# Altium schematic sheet Connectors.SchDoc
size A4; CompanyName: Technische Hochschule Nürnberg Georg Simon Ohm; Organization: UltraZohm; Address1: Kesslerplatz 12; Address2: 90489 Nürnberg; Address3: GERMANY; DocumentNumber: 2; SheetNumber: 2; SheetTotal: 2; Website: www.ultrazohm.com
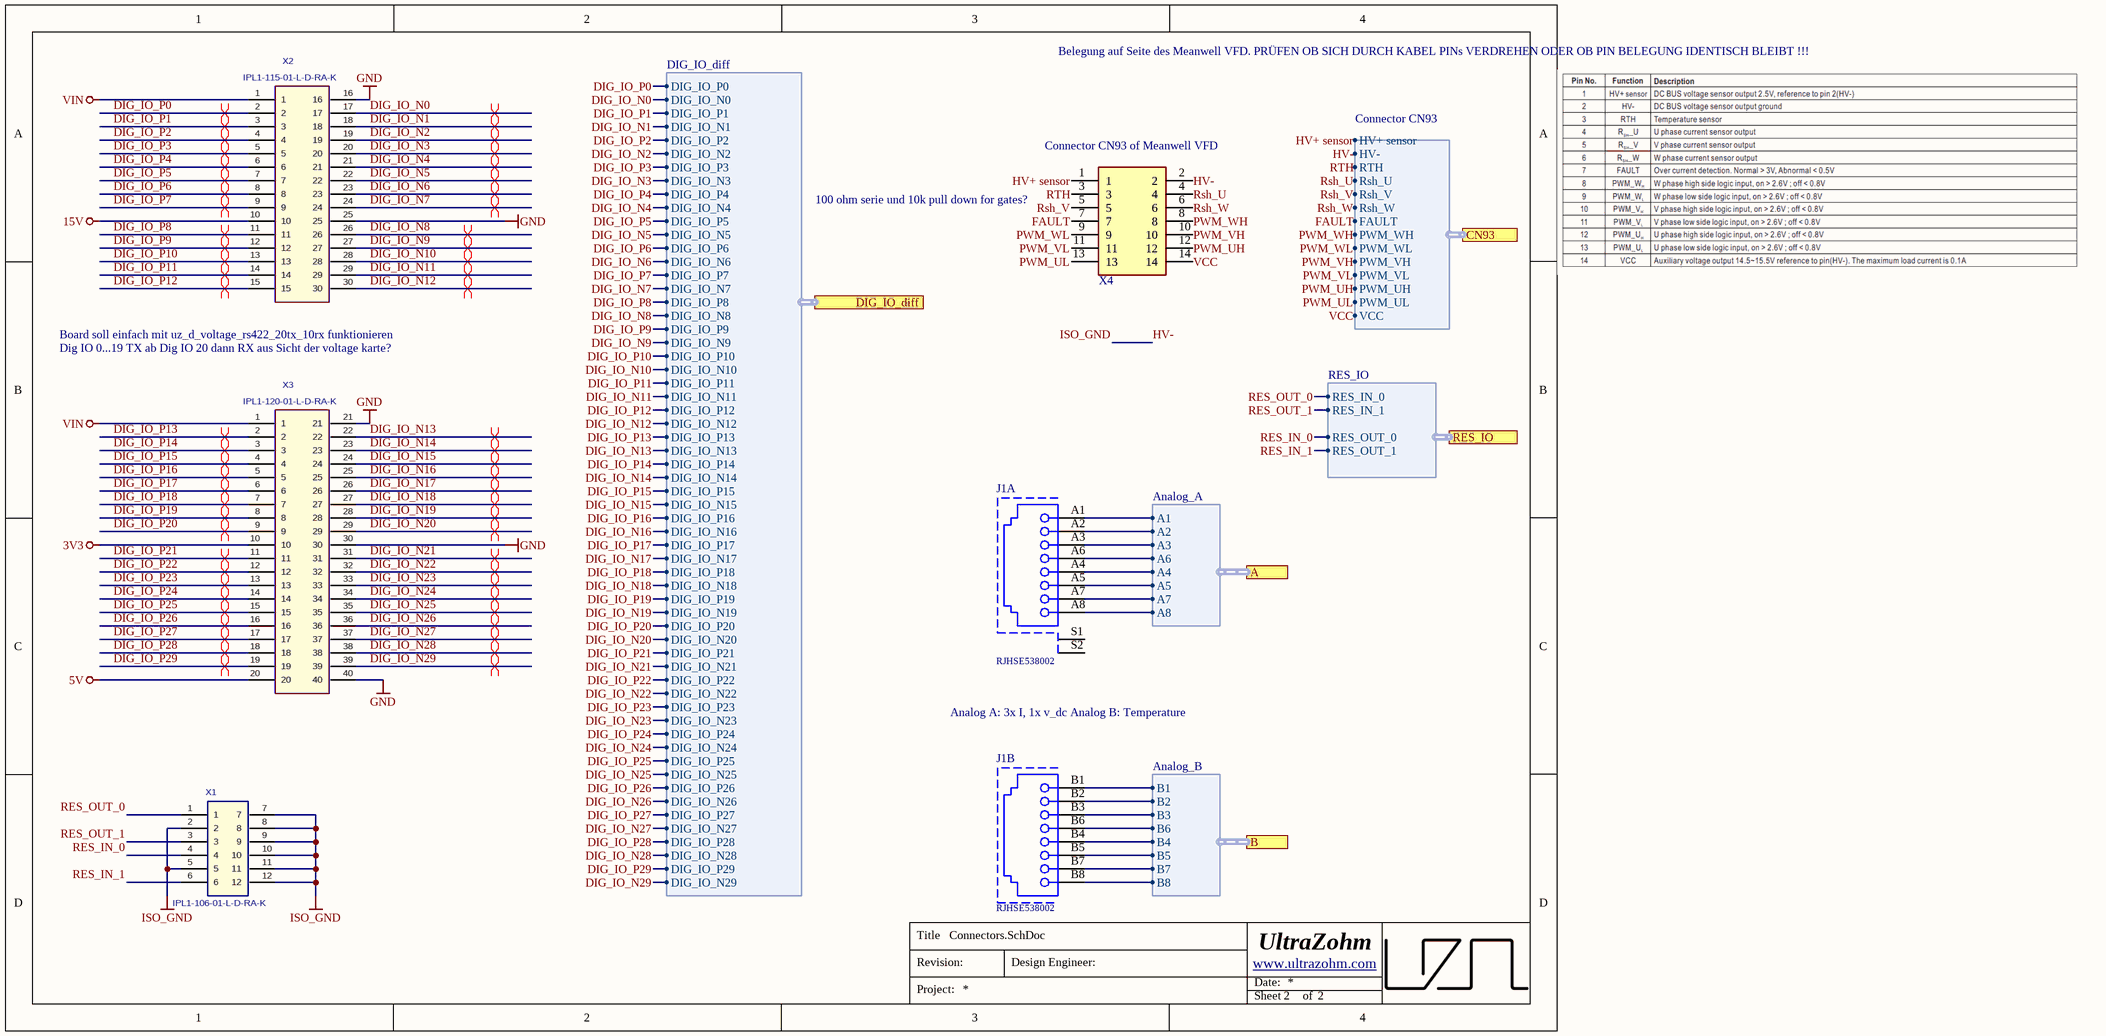
[diagram p0: Connectors.SchDoc]

## Parts
J1  RJHSE538002  [RJHSE-5380-02]  (parts A,B of 2)
X1  IPL1-106-01-L-D-RA-K  [IPL1-106-01-L-D-RA-K]
X2  IPL1-115-01-L-D-RA-K  [IPL1-115-01-XX-D-RA]
X3  IPL1-120-01-L-D-RA-K  [IPL1-120-01-XX-D-RA]
X4  (no value)  [DF11-14DP-2DS(24)]

## Ports
A (harness Analog_A), B (harness Analog_B), CN93 (harness Connector CN93), DIG_IO_diff (harness DIG_IO_diff), RES_IO (harness RES_IO)

## Harnesses
Analog_A: A2, A3, A6, A4, A5, A7, A8, A1
Analog_B: B3, B6, B4, B5, B7, B8, B1, B2
DIG_IO_diff: DIG_IO_N0, DIG_IO_P1, DIG_IO_N1, DIG_IO_P2, DIG_IO_N2, DIG_IO_P3, DIG_IO_N3, DIG_IO_P4, DIG_IO_N4, DIG_IO_P5, DIG_IO_N5, DIG_IO_P6, DIG_IO_N6, DIG_IO_P7, DIG_IO_N7, DIG_IO_P8, DIG_IO_N8, DIG_IO_P9, DIG_IO_N9, DIG_IO_P10, DIG_IO_N10, DIG_IO_P11, DIG_IO_N11, DIG_IO_P12, DIG_IO_N12, DIG_IO_N13, DIG_IO_P14, DIG_IO_N14, DIG_IO_P0, DIG_IO_P15, DIG_IO_N15, DIG_IO_P16, DIG_IO_N16, DIG_IO_P17, DIG_IO_N17, DIG_IO_P18, DIG_IO_N18, DIG_IO_P19, DIG_IO_N19, DIG_IO_P20, DIG_IO_N20, DIG_IO_P21, DIG_IO_P22, DIG_IO_N22, DIG_IO_P23, DIG_IO_N23, DIG_IO_P24, DIG_IO_N24, DIG_IO_P25, DIG_IO_N25, DIG_IO_P26, DIG_IO_N26, DIG_IO_P27, DIG_IO_N27, DIG_IO_P28, DIG_IO_N28, DIG_IO_P29, DIG_IO_N29, DIG_IO_P13, DIG_IO_N21
Connector CN93: HV+ sensor, HV-, RTH, Rsh_U, Rsh_V, Rsh_W, FAULT, PWM_WH, PWM_WL, PWM_VH, PWM_VL, PWM_UH, PWM_UL, VCC
RES_IO: RES_IN_0, RES_IN_1, RES_OUT_0, RES_OUT_1

## Nets
3V3: X3.10
5V: X3.20
15V: X2.10
GND: X2.16 X2.25 X3.21 X3.30 X3.40
HV-: X1.2 X1.5 X1.7 X1.8 X1.9 X1.10 X1.11 X1.12 X4.2 ; port CN93.HV-  [also labelled ISO_GND]
VIN: X2.1 X3.1
DIG_IO_N0: X2.17 ; port DIG_IO_diff.DIG_IO_N0
DIG_IO_N1: X2.18 ; port DIG_IO_diff.DIG_IO_N1
DIG_IO_N2: X2.19 ; port DIG_IO_diff.DIG_IO_N2
DIG_IO_N3: X2.20 ; port DIG_IO_diff.DIG_IO_N3
DIG_IO_N4: X2.21 ; port DIG_IO_diff.DIG_IO_N4
DIG_IO_N5: X2.22 ; port DIG_IO_diff.DIG_IO_N5
DIG_IO_N6: X2.23 ; port DIG_IO_diff.DIG_IO_N6
DIG_IO_N7: X2.24 ; port DIG_IO_diff.DIG_IO_N7
DIG_IO_N8: X2.26 ; port DIG_IO_diff.DIG_IO_N8
DIG_IO_N9: X2.27 ; port DIG_IO_diff.DIG_IO_N9
DIG_IO_N10: X2.28 ; port DIG_IO_diff.DIG_IO_N10
DIG_IO_N11: X2.29 ; port DIG_IO_diff.DIG_IO_N11
DIG_IO_N12: X2.30 ; port DIG_IO_diff.DIG_IO_N12
DIG_IO_N13: X3.22 ; port DIG_IO_diff.DIG_IO_N13
DIG_IO_N14: X3.23 ; port DIG_IO_diff.DIG_IO_N14
DIG_IO_N15: X3.24 ; port DIG_IO_diff.DIG_IO_N15
DIG_IO_N16: X3.25 ; port DIG_IO_diff.DIG_IO_N16
DIG_IO_N17: X3.26 ; port DIG_IO_diff.DIG_IO_N17
DIG_IO_N18: X3.27 ; port DIG_IO_diff.DIG_IO_N18
DIG_IO_N19: X3.28 ; port DIG_IO_diff.DIG_IO_N19
DIG_IO_N20: X3.29 ; port DIG_IO_diff.DIG_IO_N20
DIG_IO_N21: X3.31 ; port DIG_IO_diff.DIG_IO_N21
DIG_IO_N22: X3.32 ; port DIG_IO_diff.DIG_IO_N22
DIG_IO_N23: X3.33 ; port DIG_IO_diff.DIG_IO_N23
DIG_IO_N24: X3.34 ; port DIG_IO_diff.DIG_IO_N24
DIG_IO_N25: X3.35 ; port DIG_IO_diff.DIG_IO_N25
DIG_IO_N26: X3.36 ; port DIG_IO_diff.DIG_IO_N26
DIG_IO_N27: X3.37 ; port DIG_IO_diff.DIG_IO_N27
DIG_IO_N28: X3.38 ; port DIG_IO_diff.DIG_IO_N28
DIG_IO_N29: X3.39 ; port DIG_IO_diff.DIG_IO_N29
DIG_IO_P0: X2.2 ; port DIG_IO_diff.DIG_IO_P0
DIG_IO_P1: X2.3 ; port DIG_IO_diff.DIG_IO_P1
DIG_IO_P2: X2.4 ; port DIG_IO_diff.DIG_IO_P2
DIG_IO_P3: X2.5 ; port DIG_IO_diff.DIG_IO_P3
DIG_IO_P4: X2.6 ; port DIG_IO_diff.DIG_IO_P4
DIG_IO_P5: X2.7 ; port DIG_IO_diff.DIG_IO_P5
DIG_IO_P6: X2.8 ; port DIG_IO_diff.DIG_IO_P6
DIG_IO_P7: X2.9 ; port DIG_IO_diff.DIG_IO_P7
DIG_IO_P8: X2.11 ; port DIG_IO_diff.DIG_IO_P8
DIG_IO_P9: X2.12 ; port DIG_IO_diff.DIG_IO_P9
DIG_IO_P10: X2.13 ; port DIG_IO_diff.DIG_IO_P10
DIG_IO_P11: X2.14 ; port DIG_IO_diff.DIG_IO_P11
DIG_IO_P12: X2.15 ; port DIG_IO_diff.DIG_IO_P12
DIG_IO_P13: X3.2 ; port DIG_IO_diff.DIG_IO_P13
DIG_IO_P14: X3.3 ; port DIG_IO_diff.DIG_IO_P14
DIG_IO_P15: X3.4 ; port DIG_IO_diff.DIG_IO_P15
DIG_IO_P16: X3.5 ; port DIG_IO_diff.DIG_IO_P16
DIG_IO_P17: X3.6 ; port DIG_IO_diff.DIG_IO_P17
DIG_IO_P18: X3.7 ; port DIG_IO_diff.DIG_IO_P18
DIG_IO_P19: X3.8 ; port DIG_IO_diff.DIG_IO_P19
DIG_IO_P20: X3.9 ; port DIG_IO_diff.DIG_IO_P20
DIG_IO_P21: X3.11 ; port DIG_IO_diff.DIG_IO_P21
DIG_IO_P22: X3.12 ; port DIG_IO_diff.DIG_IO_P22
DIG_IO_P23: X3.13 ; port DIG_IO_diff.DIG_IO_P23
DIG_IO_P24: X3.14 ; port DIG_IO_diff.DIG_IO_P24
DIG_IO_P25: X3.15 ; port DIG_IO_diff.DIG_IO_P25
DIG_IO_P26: X3.16 ; port DIG_IO_diff.DIG_IO_P26
DIG_IO_P27: X3.17 ; port DIG_IO_diff.DIG_IO_P27
DIG_IO_P28: X3.18 ; port DIG_IO_diff.DIG_IO_P28
DIG_IO_P29: X3.19 ; port DIG_IO_diff.DIG_IO_P29
FAULT: X4.7 ; port CN93.FAULT
HV+ sensor: X4.1 ; port CN93.HV+ sensor
PWM_UH: X4.12 ; port CN93.PWM_UH
PWM_UL: X4.13 ; port CN93.PWM_UL
PWM_VH: X4.10 ; port CN93.PWM_VH
PWM_VL: X4.11 ; port CN93.PWM_VL
PWM_WH: X4.8 ; port CN93.PWM_WH
PWM_WL: X4.9 ; port CN93.PWM_WL
RES_IN_0: X1.4 ; port RES_IO.RES_OUT_0
RES_IN_1: X1.6 ; port RES_IO.RES_OUT_1
RES_OUT_0: X1.1 ; port RES_IO.RES_IN_0
RES_OUT_1: X1.3 ; port RES_IO.RES_IN_1
Rsh_U: X4.4 ; port CN93.Rsh_U
Rsh_V: X4.5 ; port CN93.Rsh_V
Rsh_W: X4.6 ; port CN93.Rsh_W
RTH: X4.3 ; port CN93.RTH
VCC: X4.14 ; port CN93.VCC
NetJ1_A1: J1.A1 ; port A.A1
NetJ1_A2: J1.A2 ; port A.A2
NetJ1_A3: J1.A3 ; port A.A3
NetJ1_A4: J1.A4 ; port A.A4
NetJ1_A5: J1.A5 ; port A.A5
NetJ1_A6: J1.A6 ; port A.A6
NetJ1_A7: J1.A7 ; port A.A7
NetJ1_A8: J1.A8 ; port A.A8
NetJ1_B1: J1.B1 ; port B.B1
NetJ1_B2: J1.B2 ; port B.B2
NetJ1_B3: J1.B3 ; port B.B3
NetJ1_B4: J1.B4 ; port B.B4
NetJ1_B5: J1.B5 ; port B.B5
NetJ1_B6: J1.B6 ; port B.B6
NetJ1_B7: J1.B7 ; port B.B7
NetJ1_B8: J1.B8 ; port B.B8

Not connected (* = marked no-connect by the designer): J1 S1 S2

## Layout directives
differential pair: DIG_IO_N0, DIG_IO_N1, DIG_IO_N2, DIG_IO_N3, DIG_IO_N4, DIG_IO_N5, DIG_IO_N6, DIG_IO_N7, DIG_IO_N8, DIG_IO_N9, DIG_IO_N10, DIG_IO_N11, DIG_IO_N12, DIG_IO_N13, DIG_IO_N14, DIG_IO_N15, DIG_IO_N16, DIG_IO_N17, DIG_IO_N18, DIG_IO_N19, DIG_IO_N20, DIG_IO_N21, DIG_IO_N22, DIG_IO_N23, DIG_IO_N24, DIG_IO_N25, DIG_IO_N26, DIG_IO_N27, DIG_IO_N28, DIG_IO_N29, DIG_IO_P0, DIG_IO_P1, DIG_IO_P2, DIG_IO_P3, DIG_IO_P4, DIG_IO_P5, DIG_IO_P6, DIG_IO_P7, DIG_IO_P8, DIG_IO_P9, DIG_IO_P10, DIG_IO_P11, DIG_IO_P12, DIG_IO_P13, DIG_IO_P14, DIG_IO_P15, DIG_IO_P16, DIG_IO_P17, DIG_IO_P18, DIG_IO_P19, DIG_IO_P20, DIG_IO_P21, DIG_IO_P22, DIG_IO_P23, DIG_IO_P24, DIG_IO_P25, DIG_IO_P26, DIG_IO_P27, DIG_IO_P28, DIG_IO_P29

## Notes on the sheet
- Belegung auf Seite des Meanwell VFD. PRÜFEN OB SICH DURCH KABEL PINs VERDREHEN ODER OB PIN BELEGUNG IDENTISCH BLEIBT !!!
- (near X4) Connector CN93 of Meanwell VFD
- (near X4) 100 ohm serie und 10k pull down for gates?
- (near X2) Board soll einfach mit uz_d_voltage_rs422_20tx_10rx funktionieren
- Dig IO 0...19 TX ab Dig IO 20 dann RX aus Sicht der voltage karte?
- Analog A: 3x I, 1x v_dc Analog B: Temperature
- Title
- Revision:
- Design Engineer:
- Date:
- Project:
- Sheet
- of

## Library data of the parts
J1 = RJHSE538002: CAT5, RJ45 Connector, 1x2; Manufacturer: Amphenol; Created from: MGremer; Manufacturer Part Number: RJHSE538002; PartID: 4; Created On: 22.02.2021 16:43:38; ComponentLink1Description: Datasheet; ComponentLink1URL: https://www.farnell.com/cad/2360382.pdf; Component Type: RJ45 Connector; Device Package: RJ45; Last Updated: 22.02.2021 16:43:38; Mounting Type: THT; Series: RJHSE; Supplier 1: Farnell; Supplier Part Number 1: 1860605; Type: RJ45 Connector; Live Cycle Status: 1; Stock number: not stored
X1 = IPL1-106-01-L-D-RA-K: 2.54 mm Double Row Terminal Assembly (right angle); Manufacturer: SAMTEC; Created from: MGremer; Number of positions: 6; Manufacturer Part Number: IPL1-106-01-L-D-RA-K; PartID: 12; Created On: 30.11.2020 10:28:12; ComponentLink1Description: Homepage; ComponentLink1URL: https://www.samtec.com/products/ipl1; Component Type: Samtec Connector; Device Package: Connector; Last Updated: 15.02.2021 09:17:39; Mounting Type: THT; Supplier 1: SAMTEC; Supplier Part Number 1: IPL1-106-01-L-D-RA-K; Type: Connector; Live Cycle Status: 1; Number of rows: 2; Stock number: not stored
X2 = IPL1-115-01-L-D-RA-K: Terminal Assembly, Double Row, Right Angle, Thru-Hole, 2.54 mm x 2.54 mm Pitch, 30 Pins; Manufacturer: SAMTEC; Created from: TWendt; Number of positions: 30; Manufacturer Part Number: IPL1-115-01-L-D-RA-K; PartID: 34; Created On: 12.02.2021 15:31:18; ComponentLink1Description: Homepage; ComponentLink1URL: https://www.samtec.com/products/ipl1; Component Type: Samtec Connector; Device Package: Connector; Last Updated: 15.02.2021 10:07:42; Supplier 1: SAMTEC; Supplier Part Number 1: IPL1-115-01-L-D-RA-K; Type: Connector; Live Cycle Status: 1; Number of rows: 2; Stock number: not stored
X3 = IPL1-120-01-L-D-RA-K: Terminal Assembly, Double Row, Right Angle, Thru-Hole, 2.54 mm x 2.54 mm Pitch, 40 Pins; Manufacturer: SAMTEC; Created from: TWendt; Number of positions: 40; Manufacturer Part Number: IPL1-120-01-L-D-RA-K; PartID: 33; Created On: 12.02.2021 15:26:11; ComponentLink1Description: Homepage; ComponentLink1URL: https://www.samtec.com/products/ipl1; Component Type: Samtec Connector; Device Package: Connector; Last Updated: 15.02.2021 10:07:42; Mounting Type: THT; Supplier 1: SAMTEC; Supplier Part Number 1: IPL1-120-01-L-D-RA-K; Type: Connector; Live Cycle Status: 1; Number of rows: 2; Stock number: not stored
X4 = DF11-14DP-2DS(24): Sockel & Kabelgehäuse 2MM R/A PCB HEADER 14P DR THRU-HOLE TIN; Manufacturer: Hirose Connector; Created from: FRosner; Manufacturer Part Number: DF11-14DP-2DS(24); PartID: 74; Created On: 29.05.2026 08:10:33; ComponentLink1Description: Datasheet; ComponentLink1URL: https://www.hirose.com/product/download/?distributor=all&type=2d&lang=en&num=DF11-14DP-2DS(24); Last Updated: 29.05.2026 08:10:33; Mounting Type: THT; Operating Temperature: -30 °C to +85 °C; Series: DF11; Supplier 1: Mouser; Supplier Part Number 1: 798-DF11-14DP-2DS24; Supplier 2: LCSC; Supplier Part Number 2: C5440913; Value: DF11-14DP-2DS(24); LCSC Part Number: C5440913